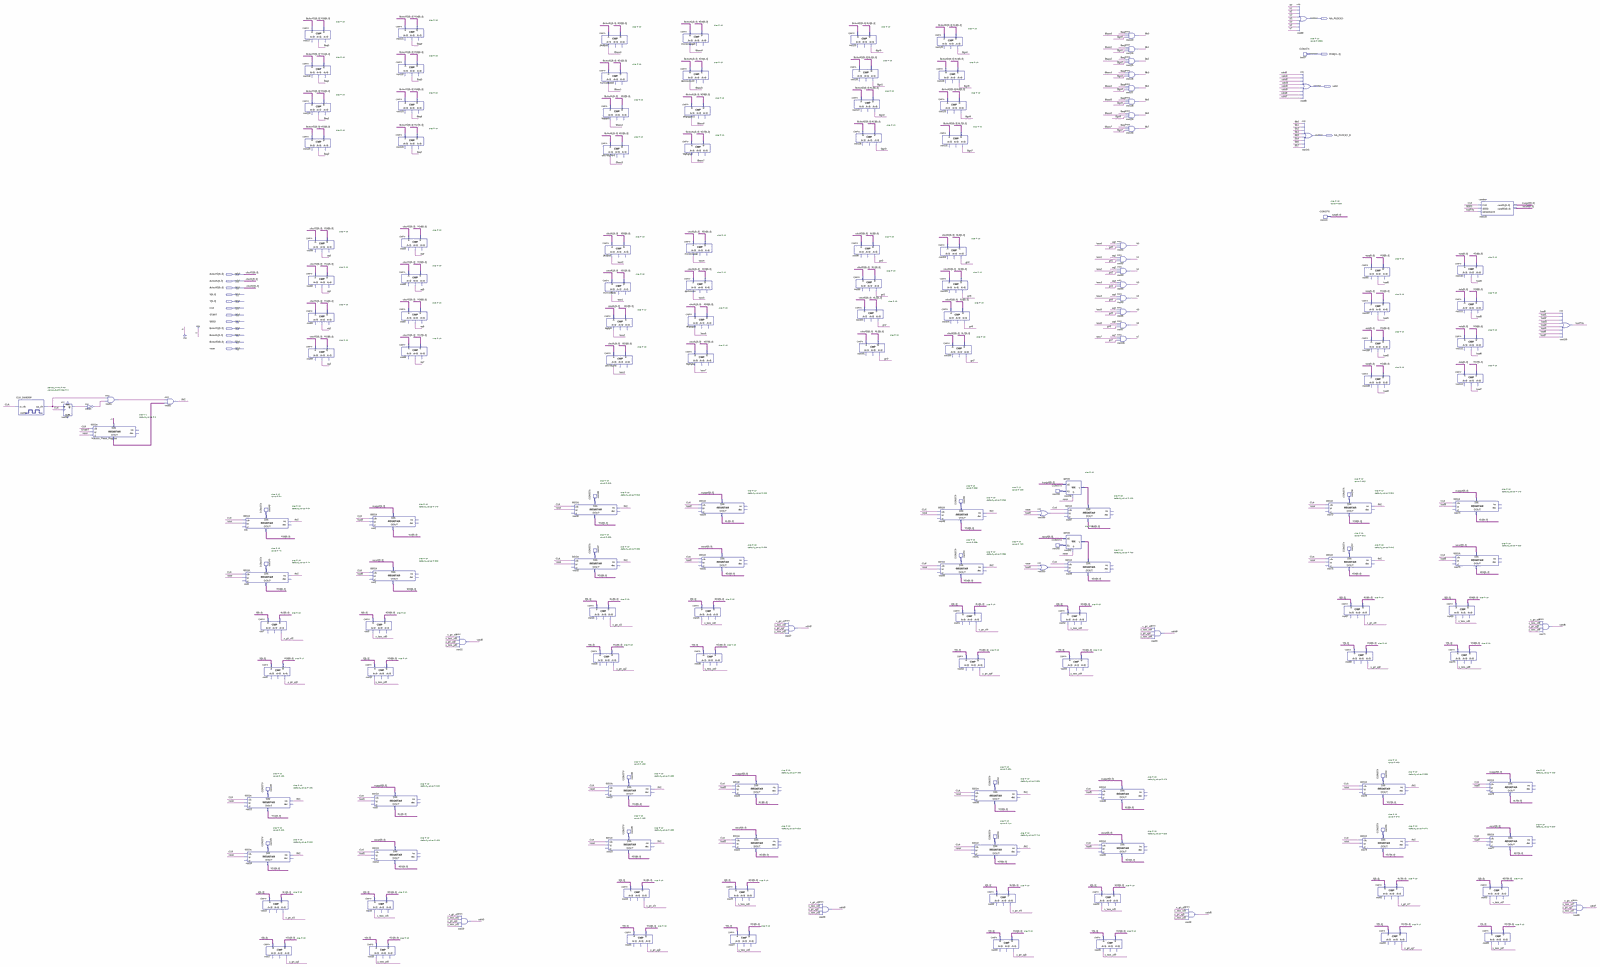
[diagram p0: schematic sheet, whole]
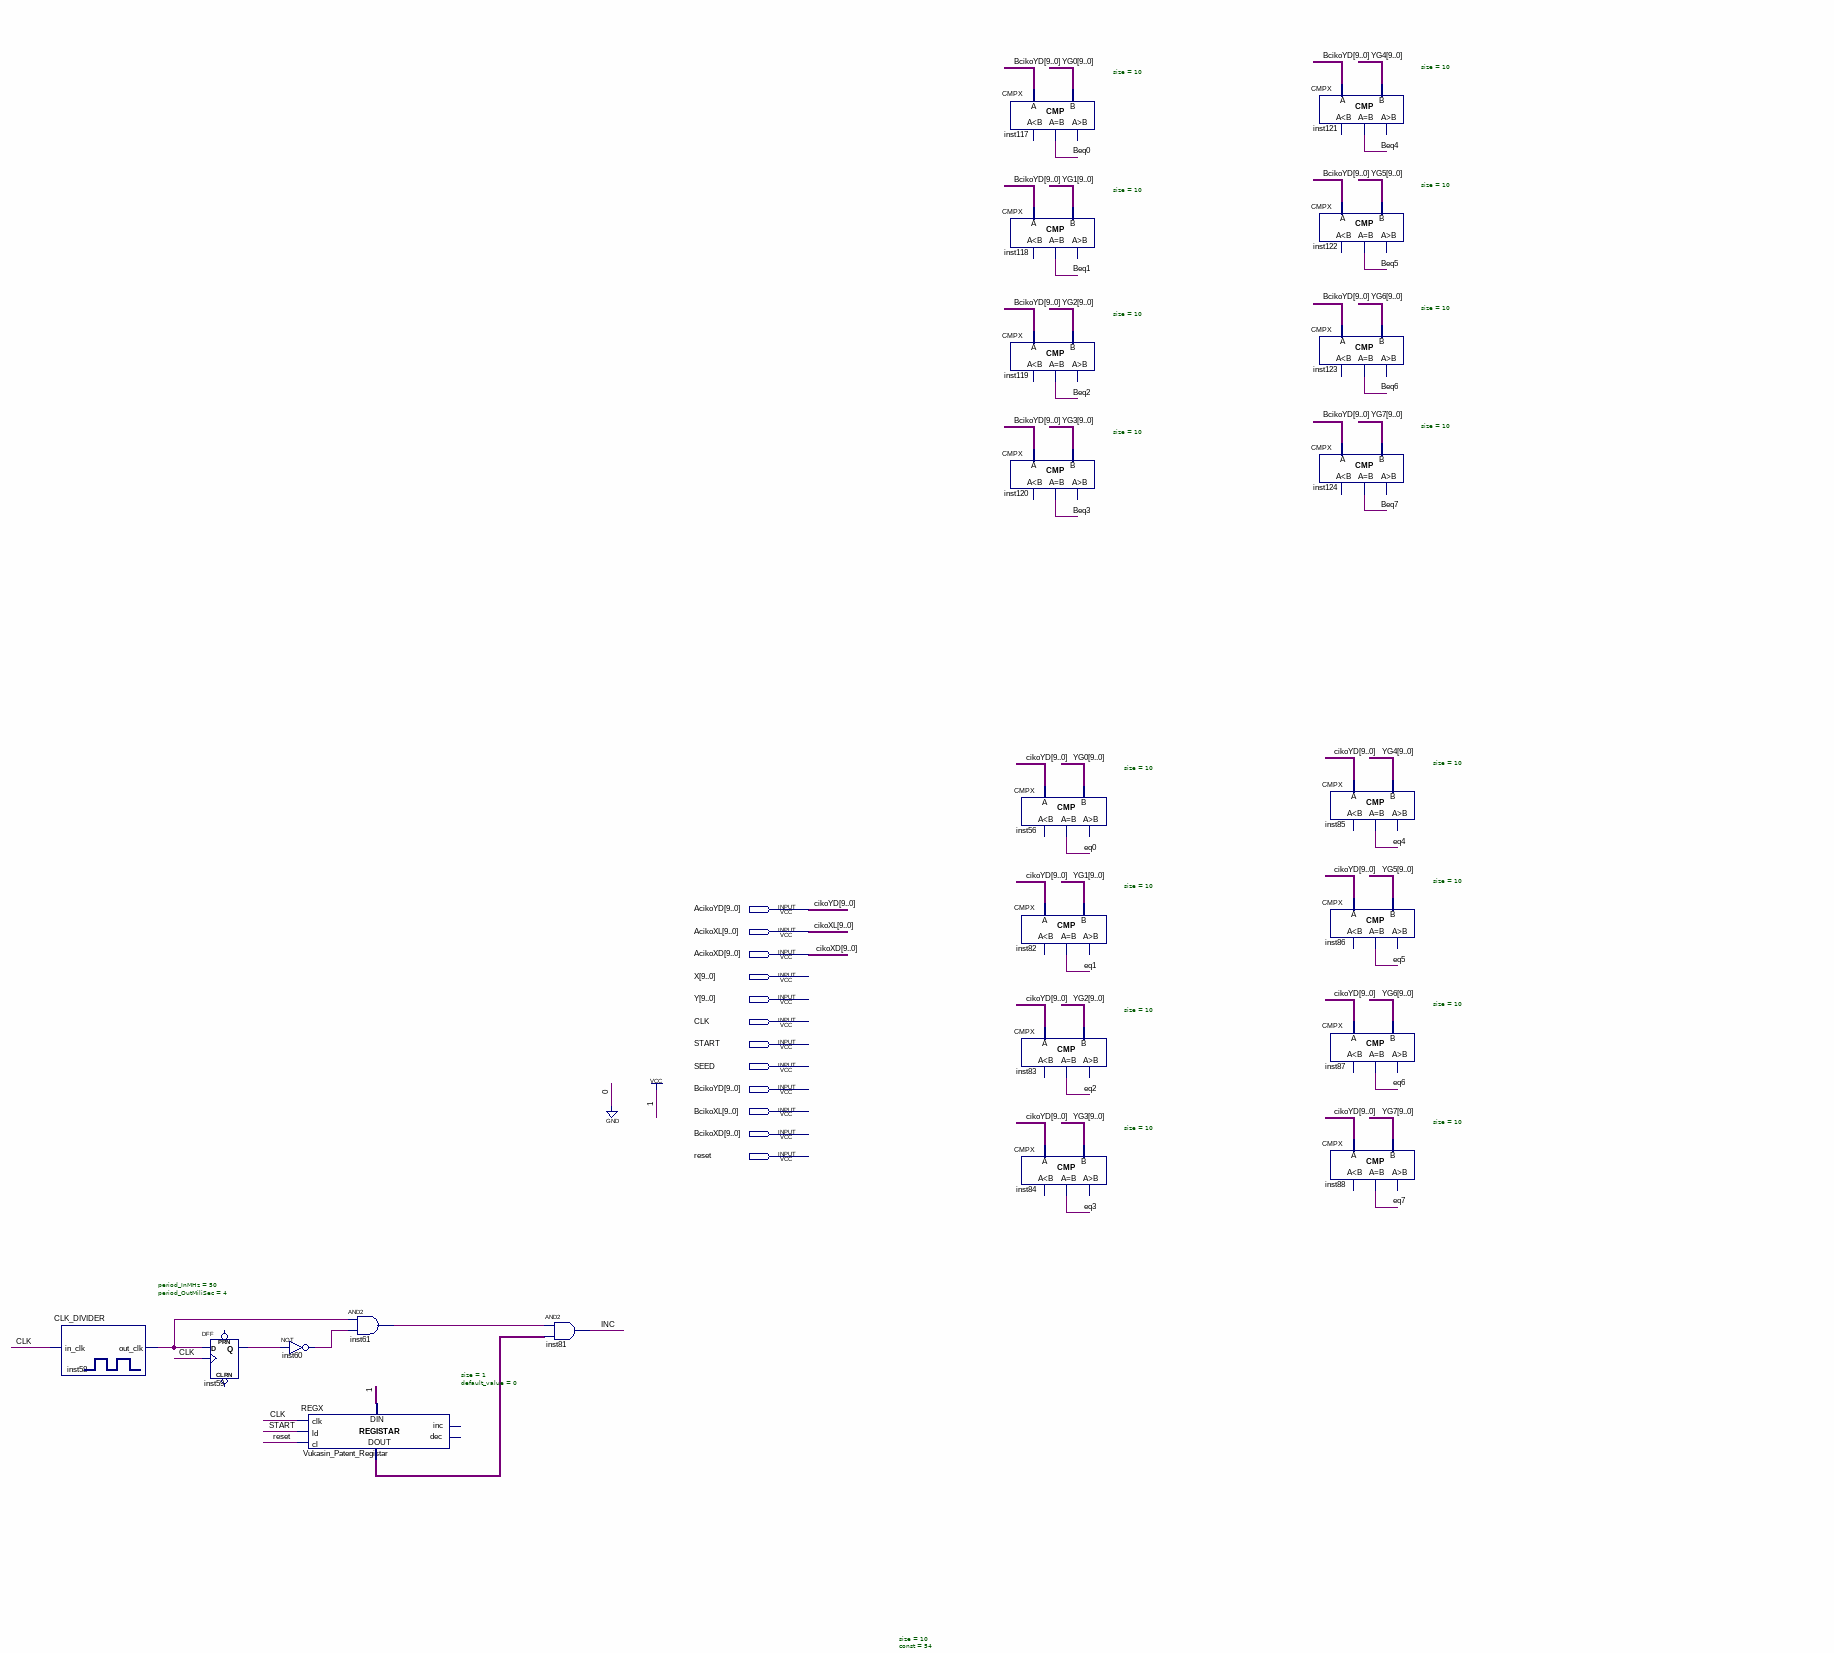
[diagram p1: schematic sheet, upper left part]
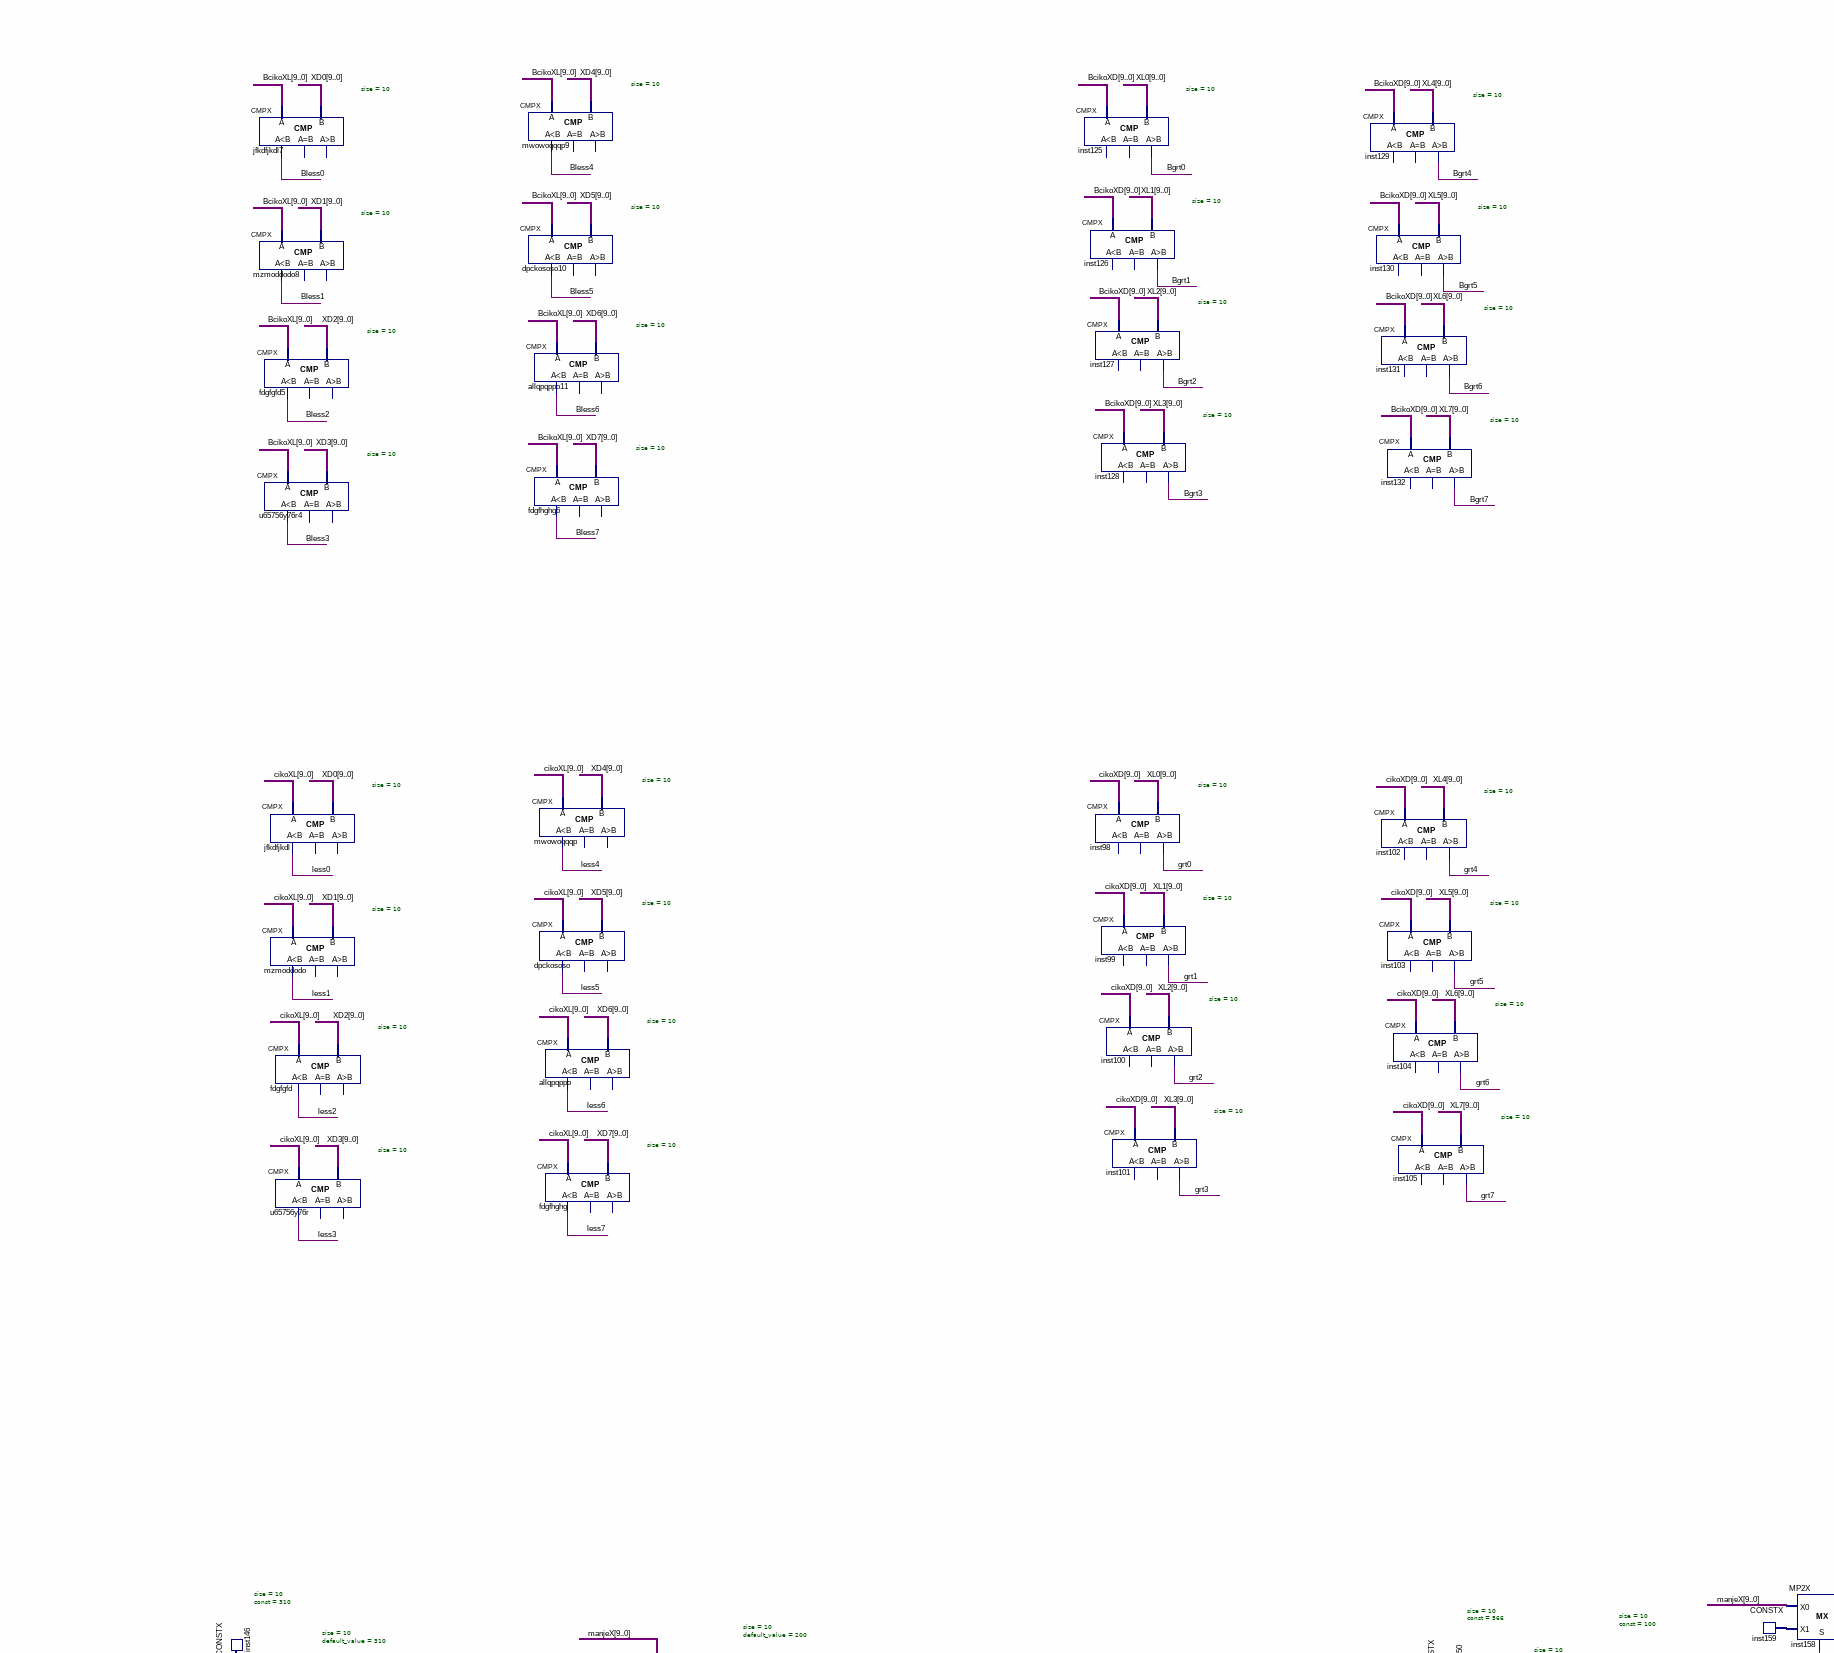
[diagram p2: schematic sheet, upper centre part]
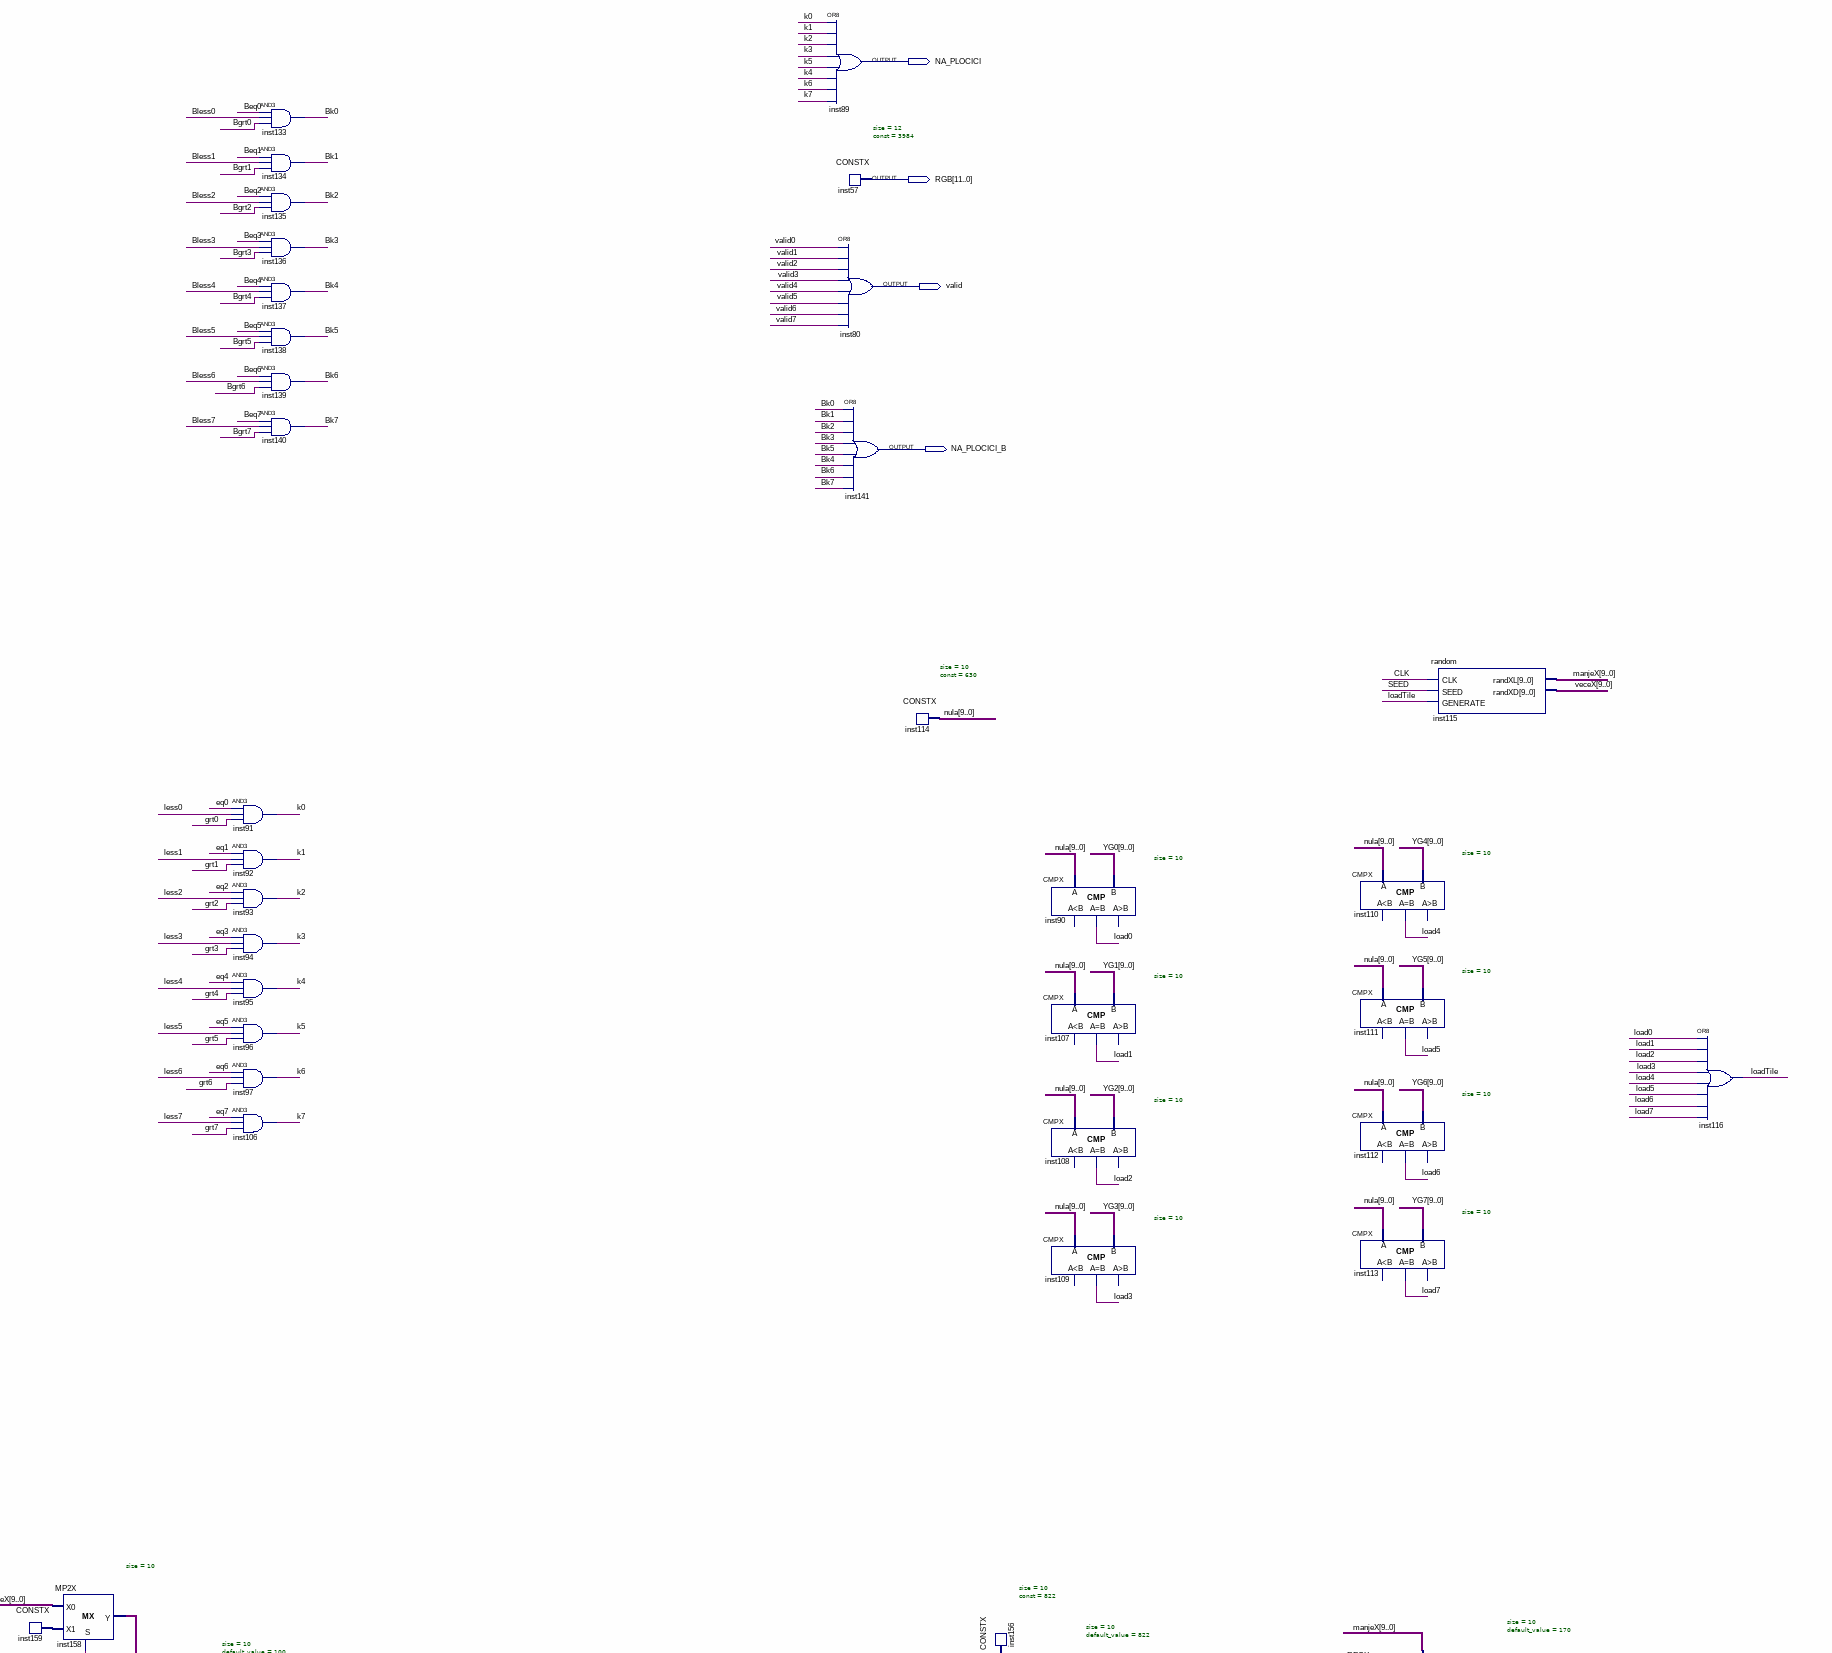
[diagram p3: schematic sheet, upper right part]
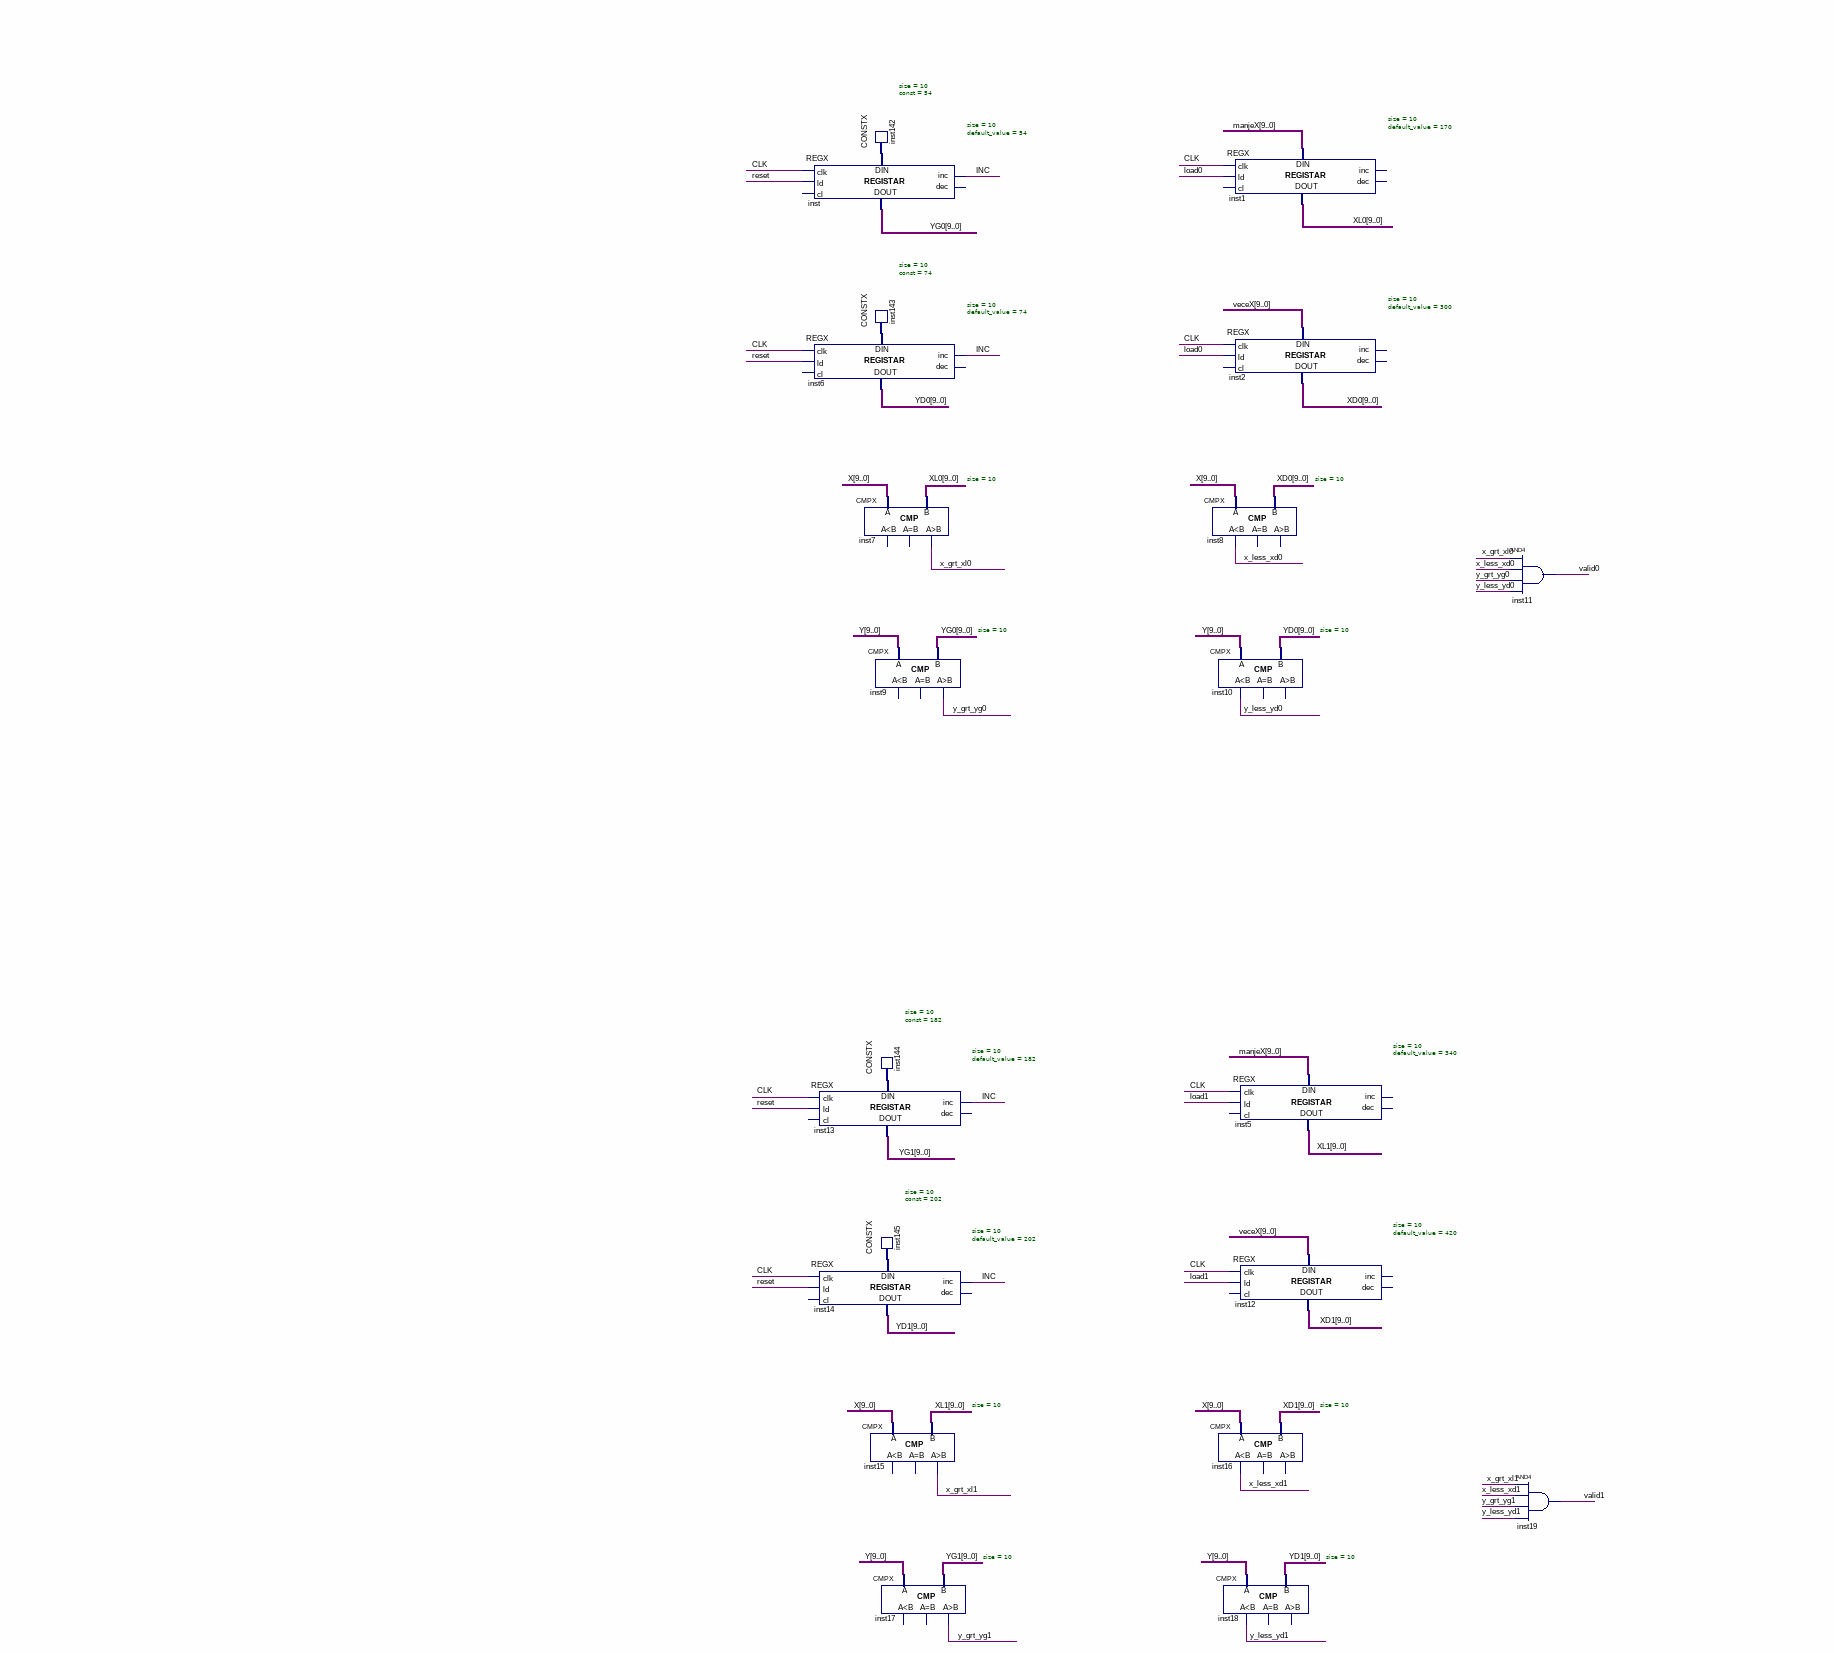
[diagram p4: schematic sheet, lower left part]
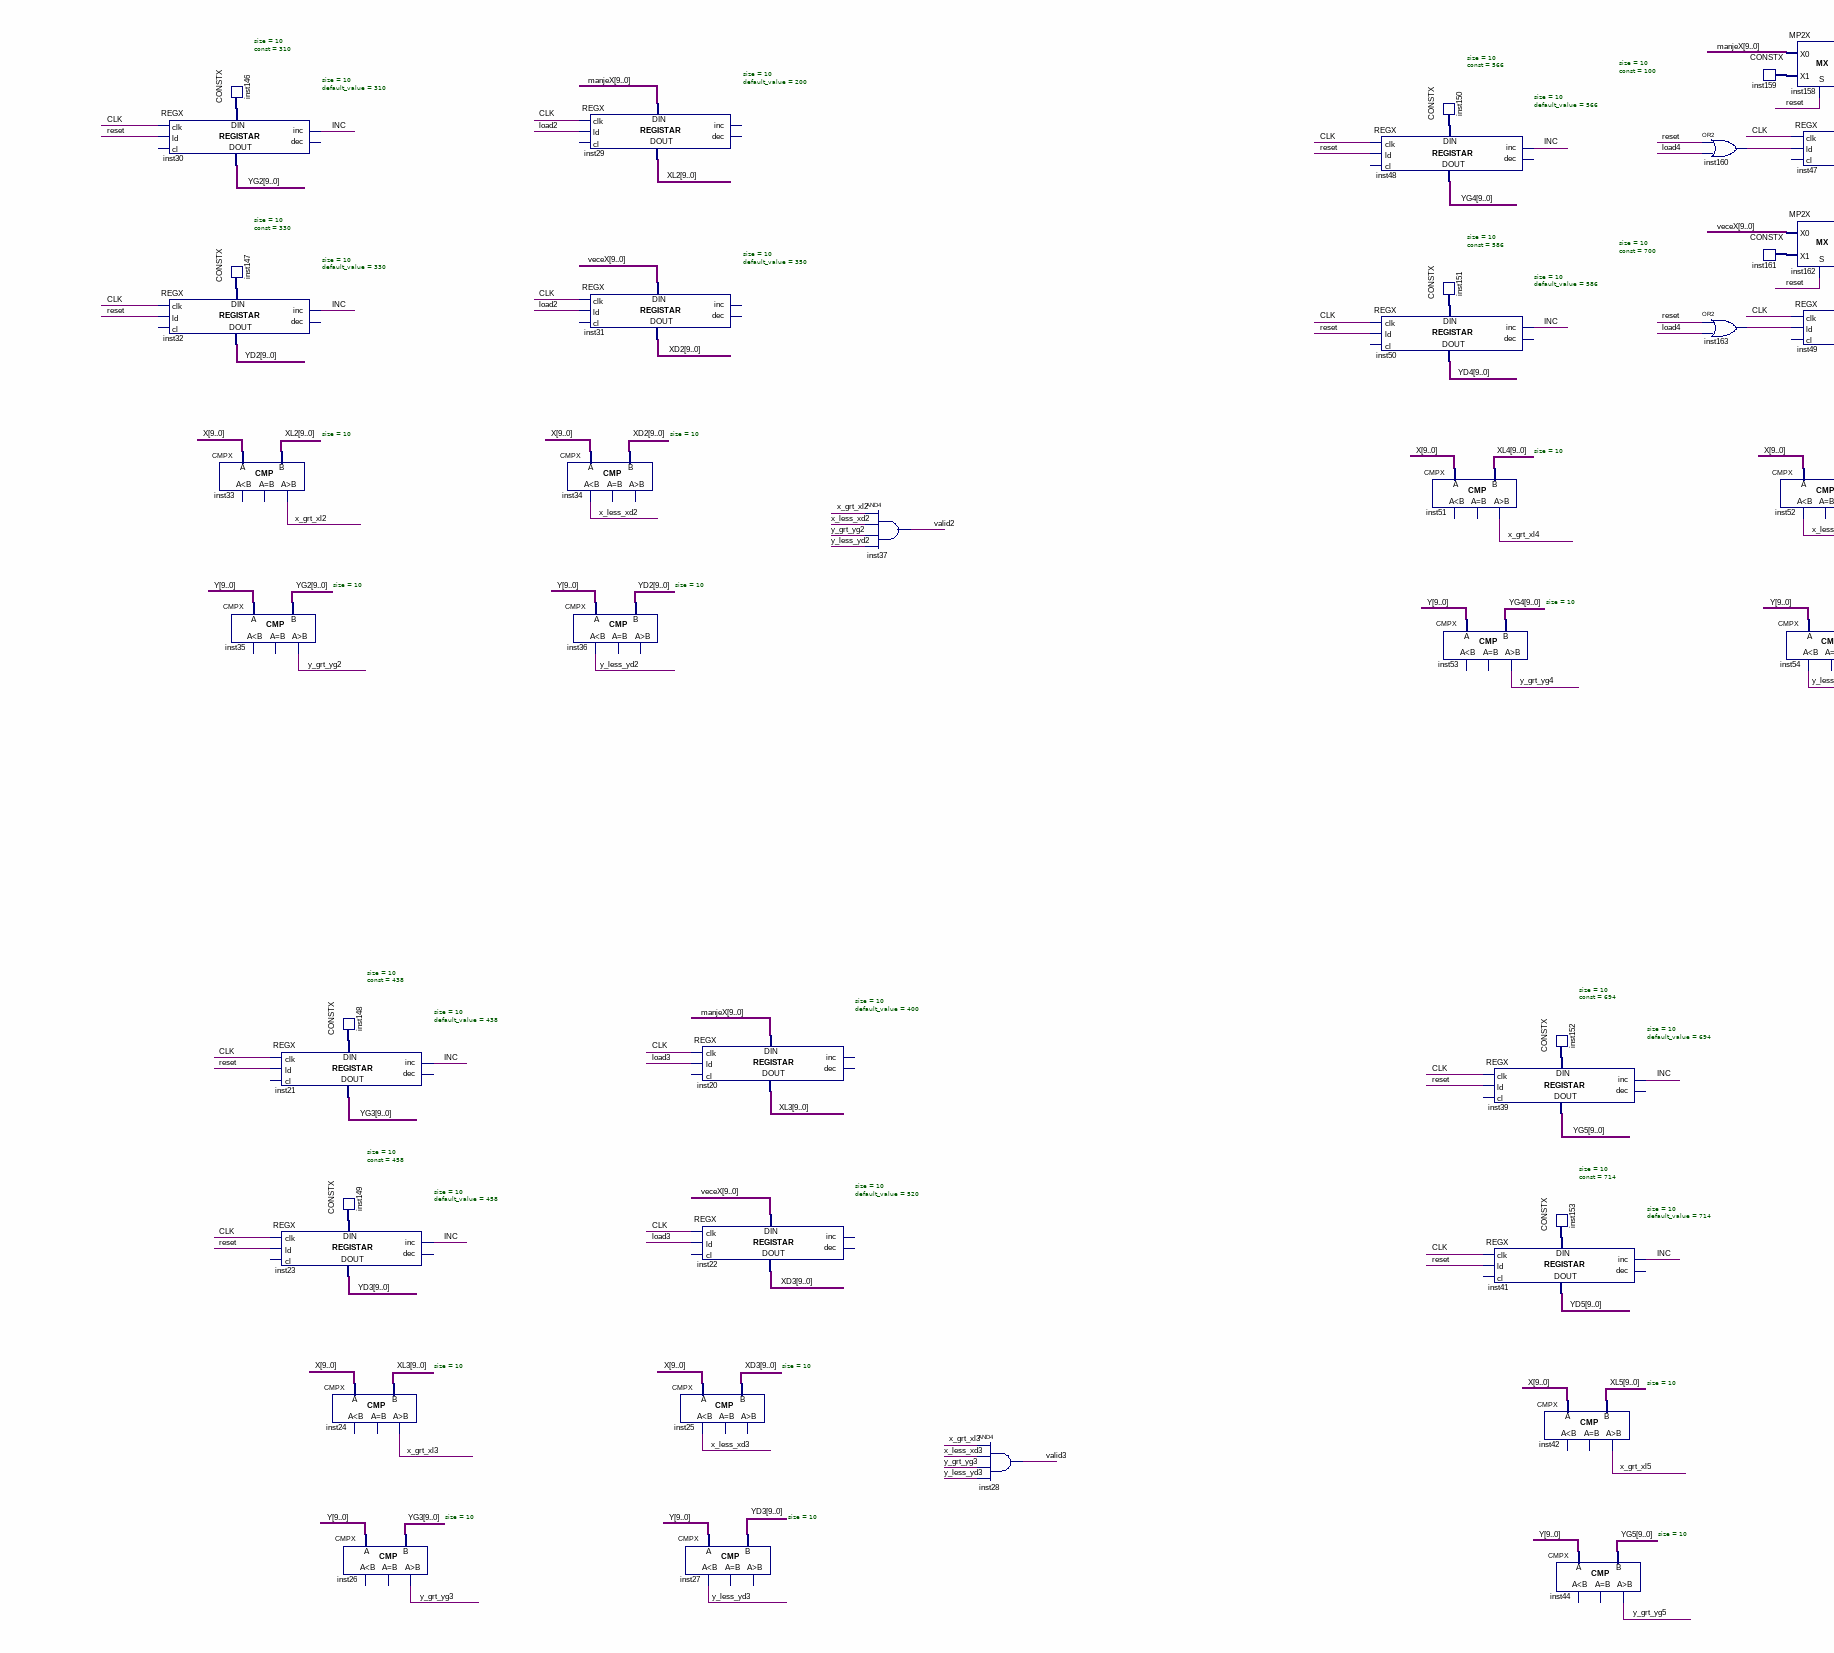
[diagram p5: schematic sheet, lower centre part]
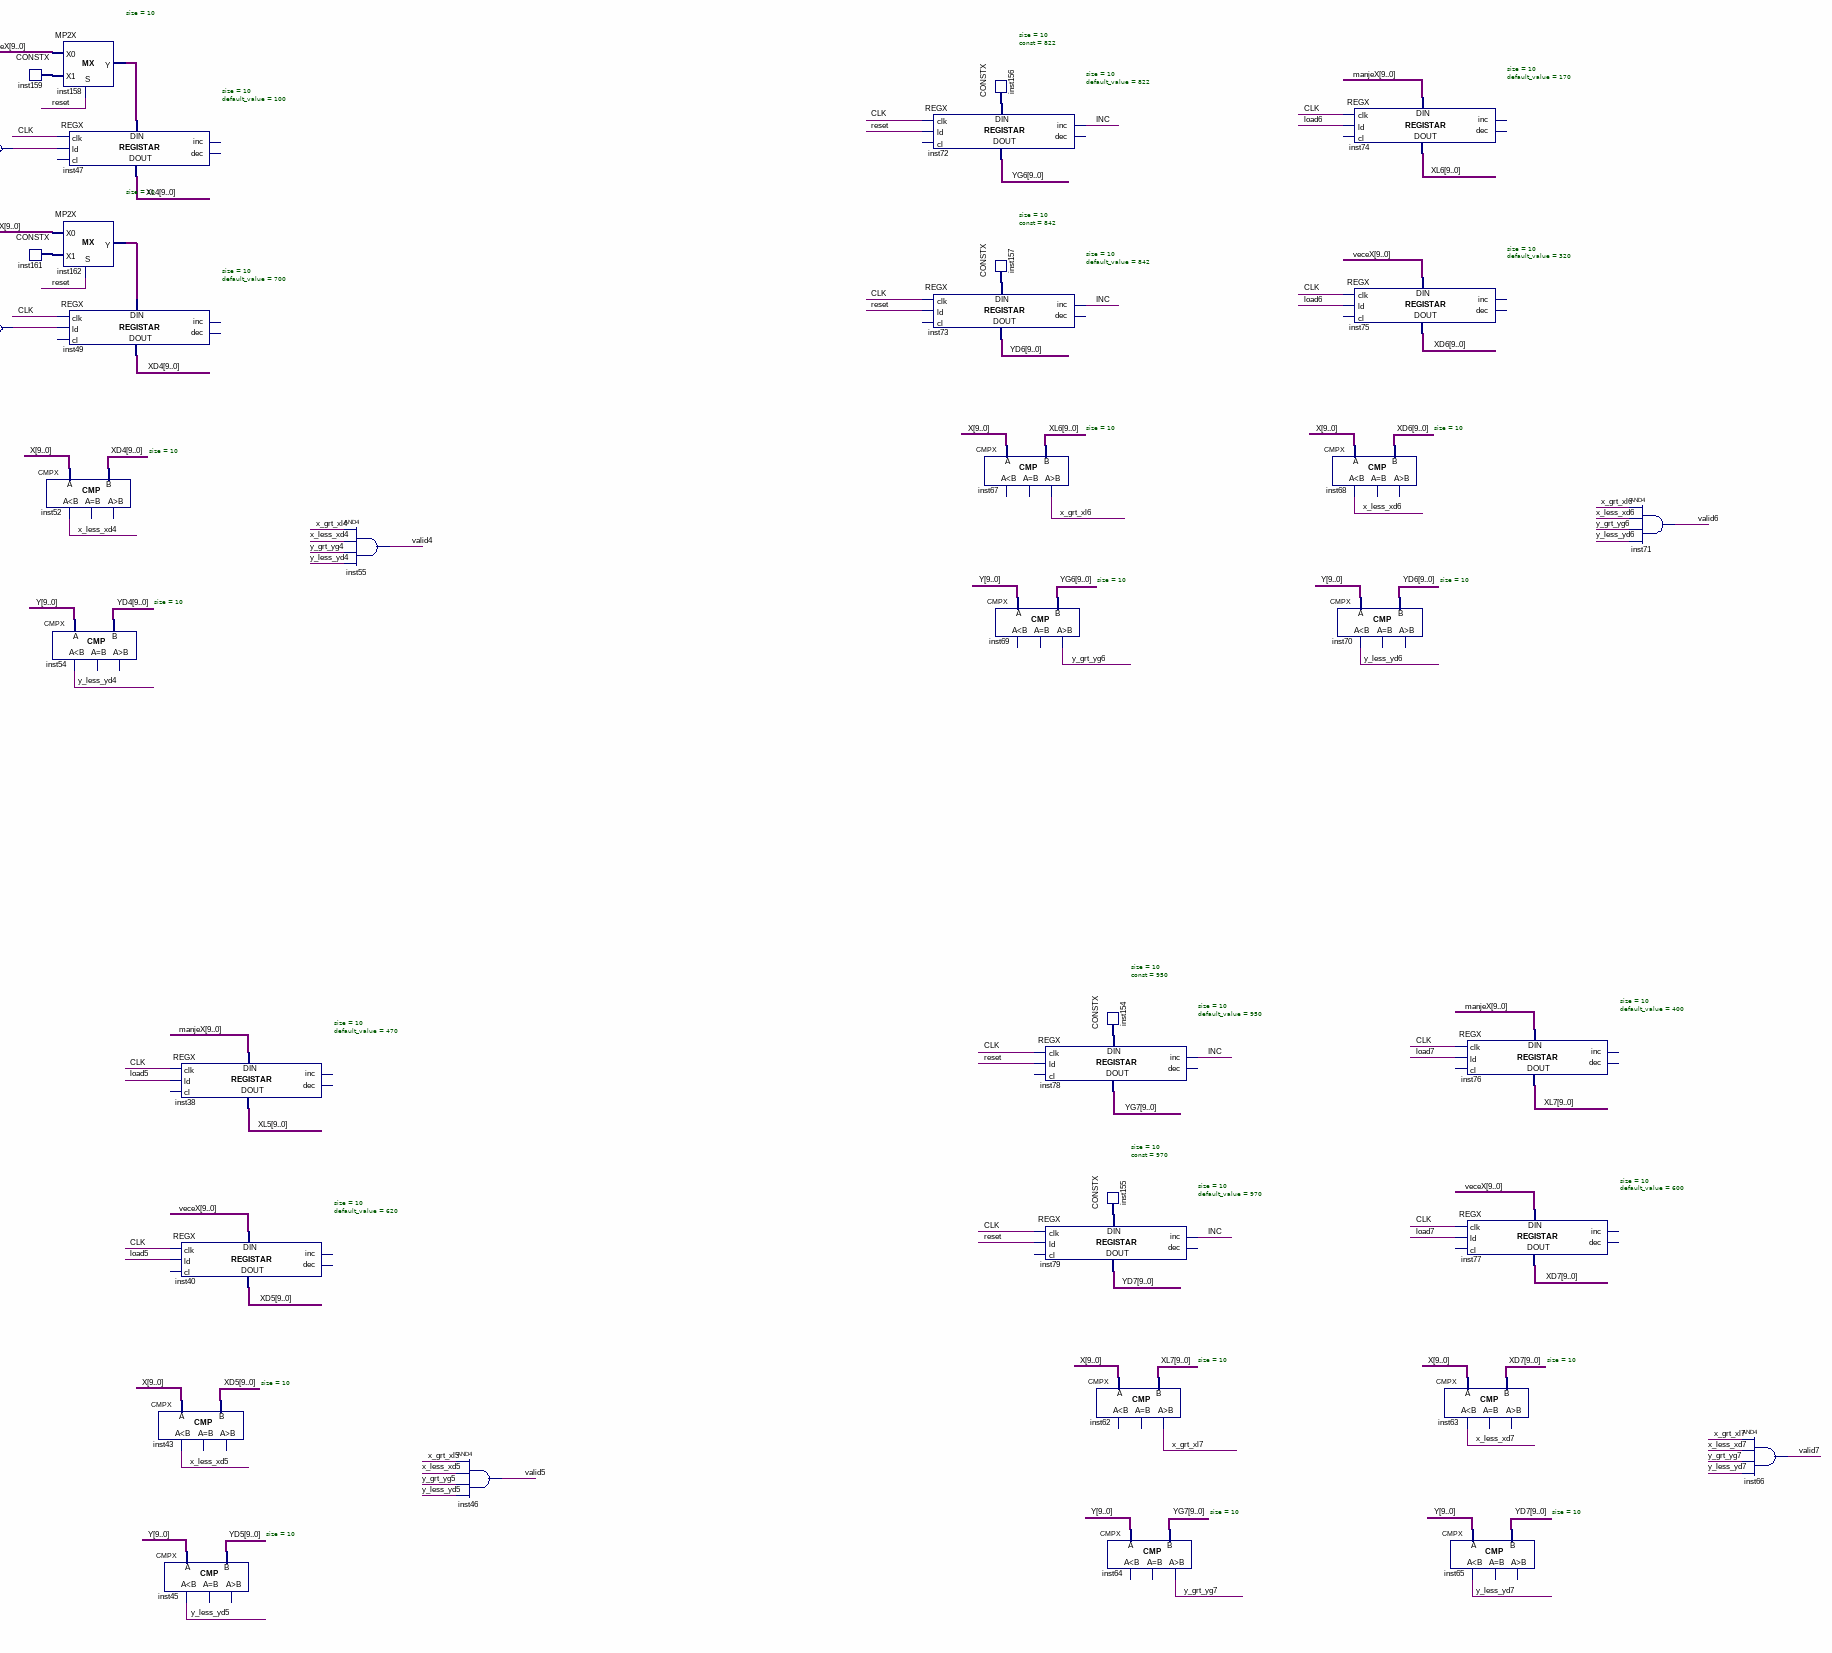
[diagram p6: schematic sheet, lower right part]
// Quartus schematic plocice.bdf as structural Verilog: 179 symbols, 16 pins
module plocice (
  input  [9:0] AcikoYD,
  input  [9:0] AcikoXL,
  input  [9:0] AcikoXD,
  input  [9:0] X,
  input  [9:0] Y,
  input  CLK,
  input  START,
  input  SEED,
  input  [9:0] BcikoYD,
  input  [9:0] BcikoXL,
  input  [9:0] BcikoXD,
  input  reset,
  output NA_PLOCICI,
  output [11:0] RGB,
  output valid,
  output NA_PLOCICI_B
);

  wire Beq0, Beq1, Beq2, Beq3, Beq4, Beq5, Beq6, Beq7, Bgrt0, Bgrt1, Bgrt2, Bgrt3, Bgrt4, Bgrt5, Bgrt6,
       Bgrt7, Bk0, Bk1, Bk2, Bk3, Bk4, Bk5, Bk6, Bk7, Bless0, Bless1, Bless2, Bless3, Bless4, Bless5, Bless6,
       Bless7, eq0, eq1, eq2, eq3, eq4, eq5, eq6, eq7, grt0, grt1, grt2, grt3, grt4, grt5, grt6, grt7, INC,
       inst58_out_clk, inst59_q, inst60_out, inst61_out, inst160_out, inst163_out, k0, k1, k2, k3, k4, k5,
       k6, k7, less0, less1, less2, less3, less4, less5, less6, less7, load0, load1, load2, load3, load4,
       load5, load6, load7, loadTile, valid0, valid1, valid2, valid3, valid4, valid5, valid6, valid7,
       Vukasin_Patent_Registar_data_out, x_grt_xl0, x_grt_xl1, x_grt_xl2, x_grt_xl3, x_grt_xl4, x_grt_xl5,
       x_grt_xl6, x_grt_xl7, x_less_xd0, x_less_xd1, x_less_xd2, x_less_xd3, x_less_xd4, x_less_xd5,
       x_less_xd6, x_less_xd7, y_grt_yg0, y_grt_yg1, y_grt_yg2, y_grt_yg3, y_grt_yg4, y_grt_yg5, y_grt_yg6,
       y_grt_yg7, y_less_yd0, y_less_yd1, y_less_yd2, y_less_yd3, y_less_yd4, y_less_yd5, y_less_yd6,
       y_less_yd7;
  wire [9:0] inst142_data, inst143_data, inst144_data, inst145_data, inst146_data, inst147_data,
       inst148_data, inst149_data, inst150_data, inst151_data, inst152_data, inst153_data, inst154_data,
       inst155_data, inst156_data, inst157_data, inst158_y, inst159_data, inst161_data, inst162_y, manjeX,
       nula, veceX, XD0, XD1, XD2, XD3, XD4, XD5, XD6, XD7, XL0, XL1, XL2, XL3, XL4, XL5, XL6, XL7, YD0, YD1,
       YD2, YD3, YD4, YD5, YD6, YD7, YG0, YG1, YG2, YG3, YG4, YG5, YG6, YG7;

  CLK_DIVIDER #(.period_InMHz(50), .period_OutMiliSec(4)) inst58 (.in_clk(CLK), .out_clk(inst58_out_clk));
  DFF inst59 (.CLK(CLK), .D(inst58_out_clk), .Q(inst59_q));  // open: CLRN, PRN
  not inst60 (inst60_out, inst59_q);
  REGX #(.size(1), .default_value(0)) Vukasin_Patent_Registar (
    .clk(CLK), .ld(START), .cl(reset), .data_in(1'b1), .data_out(Vukasin_Patent_Registar_data_out));  // open: inc, dec
  and inst61 (inst61_out, inst58_out_clk, inst60_out);
  and inst81 (INC, inst61_out, Vukasin_Patent_Registar_data_out);
  REGX #(.size(10), .default_value(54)) inst (
    .clk(CLK), .ld(reset), .inc(INC), .data_in(inst142_data), .data_out(YG0));  // open: cl, dec
  REGX #(.size(10), .default_value(74)) inst6 (
    .clk(CLK), .ld(reset), .inc(INC), .data_in(inst143_data), .data_out(YD0));  // open: cl, dec
  REGX #(.size(10), .default_value(182)) inst13 (
    .clk(CLK), .ld(reset), .inc(INC), .data_in(inst144_data), .data_out(YG1));  // open: cl, dec
  REGX #(.size(10), .default_value(202)) inst14 (
    .clk(CLK), .ld(reset), .inc(INC), .data_in(inst145_data), .data_out(YD1));  // open: cl, dec
  CONSTX #(.size(10), .\const (54)) inst142 (.data(inst142_data));
  CONSTX #(.size(10), .\const (74)) inst143 (.data(inst143_data));
  CMPX #(.size(10)) inst7 (.A(X), .B(XL0), .gr(x_grt_xl0));  // open: ls, eq
  CMPX #(.size(10)) inst9 (.A(Y), .B(YG0), .gr(y_grt_yg0));  // open: ls, eq
  CONSTX #(.size(10), .\const (182)) inst144 (.data(inst144_data));
  CONSTX #(.size(10), .\const (202)) inst145 (.data(inst145_data));
  CMPX #(.size(10)) inst15 (.A(X), .B(XL1), .gr(x_grt_xl1));  // open: ls, eq
  CMPX #(.size(10)) inst17 (.A(Y), .B(YG1), .gr(y_grt_yg1));  // open: ls, eq
  CMPX #(.size(10)) inst117 (.A(BcikoYD), .B(YG0), .eq(Beq0));  // open: ls, gr
  CMPX #(.size(10)) inst118 (.A(BcikoYD), .B(YG1), .eq(Beq1));  // open: ls, gr
  CMPX #(.size(10)) inst119 (.A(BcikoYD), .B(YG2), .eq(Beq2));  // open: ls, gr
  CMPX #(.size(10)) inst120 (.A(BcikoYD), .B(YG3), .eq(Beq3));  // open: ls, gr
  CMPX #(.size(10)) inst56 (.A(AcikoYD), .B(YG0), .eq(eq0));  // open: ls, gr
  CMPX #(.size(10)) inst82 (.A(AcikoYD), .B(YG1), .eq(eq1));  // open: ls, gr
  CMPX #(.size(10)) inst83 (.A(AcikoYD), .B(YG2), .eq(eq2));  // open: ls, gr
  CMPX #(.size(10)) inst84 (.A(AcikoYD), .B(YG3), .eq(eq3));  // open: ls, gr
  CMPX #(.size(10)) inst8 (.A(X), .B(XD0), .ls(x_less_xd0));  // open: eq, gr
  REGX #(.size(10), .default_value(170)) inst1 (
    .clk(CLK), .ld(load0), .data_in(manjeX), .data_out(XL0));  // open: cl, inc, dec
  REGX #(.size(10), .default_value(300)) inst2 (
    .clk(CLK), .ld(load0), .data_in(veceX), .data_out(XD0));  // open: cl, inc, dec
  CMPX #(.size(10)) inst10 (.A(Y), .B(YD0), .ls(y_less_yd0));  // open: eq, gr
  REGX #(.size(10), .default_value(340)) inst5 (
    .clk(CLK), .ld(load1), .data_in(manjeX), .data_out(XL1));  // open: cl, inc, dec
  REGX #(.size(10), .default_value(420)) inst12 (
    .clk(CLK), .ld(load1), .data_in(veceX), .data_out(XD1));  // open: cl, inc, dec
  CMPX #(.size(10)) inst16 (.A(X), .B(XD1), .ls(x_less_xd1));  // open: eq, gr
  CMPX #(.size(10)) inst18 (.A(Y), .B(YD1), .ls(y_less_yd1));  // open: eq, gr
  CMPX #(.size(10)) inst121 (.A(BcikoYD), .B(YG4), .eq(Beq4));  // open: ls, gr
  CMPX #(.size(10)) inst122 (.A(BcikoYD), .B(YG5), .eq(Beq5));  // open: ls, gr
  CMPX #(.size(10)) inst123 (.A(BcikoYD), .B(YG6), .eq(Beq6));  // open: ls, gr
  CMPX #(.size(10)) inst124 (.A(BcikoYD), .B(YG7), .eq(Beq7));  // open: ls, gr
  CMPX #(.size(10)) inst85 (.A(AcikoYD), .B(YG4), .eq(eq4));  // open: ls, gr
  CMPX #(.size(10)) inst86 (.A(AcikoYD), .B(YG5), .eq(eq5));  // open: ls, gr
  CMPX #(.size(10)) inst87 (.A(AcikoYD), .B(YG6), .eq(eq6));  // open: ls, gr
  CMPX #(.size(10)) inst88 (.A(AcikoYD), .B(YG7), .eq(eq7));  // open: ls, gr
  and inst11 (valid0, x_grt_xl0, x_less_xd0, y_grt_yg0, y_less_yd0);
  and inst19 (valid1, x_grt_xl1, x_less_xd1, y_grt_yg1, y_less_yd1);
  REGX #(.size(10), .default_value(310)) inst30 (
    .clk(CLK), .ld(reset), .inc(INC), .data_in(inst146_data), .data_out(YG2));  // open: cl, dec
  REGX #(.size(10), .default_value(330)) inst32 (
    .clk(CLK), .ld(reset), .inc(INC), .data_in(inst147_data), .data_out(YD2));  // open: cl, dec
  CONSTX #(.size(10), .\const (310)) inst146 (.data(inst146_data));
  CONSTX #(.size(10), .\const (330)) inst147 (.data(inst147_data));
  CMPX #(.size(10)) inst33 (.A(X), .B(XL2), .gr(x_grt_xl2));  // open: ls, eq
  CMPX #(.size(10)) inst35 (.A(Y), .B(YG2), .gr(y_grt_yg2));  // open: ls, eq
  CMPX #(.size(10)) jfkdfjkdl7 (.A(BcikoXL), .B(XD0), .ls(Bless0));  // open: eq, gr
  CMPX #(.size(10)) mzmoddodo8 (.A(BcikoXL), .B(XD1), .ls(Bless1));  // open: eq, gr
  CMPX #(.size(10)) fdgfgfd5 (.A(BcikoXL), .B(XD2), .ls(Bless2));  // open: eq, gr
  CMPX #(.size(10)) u65756y76r4 (.A(BcikoXL), .B(XD3), .ls(Bless3));  // open: eq, gr
  CMPX #(.size(10)) jfkdfjkdl (.A(AcikoXL), .B(XD0), .ls(less0));  // open: eq, gr
  CMPX #(.size(10)) mzmoddodo (.A(AcikoXL), .B(XD1), .ls(less1));  // open: eq, gr
  CMPX #(.size(10)) fdgfgfd (.A(AcikoXL), .B(XD2), .ls(less2));  // open: eq, gr
  CMPX #(.size(10)) u65756y76r (.A(AcikoXL), .B(XD3), .ls(less3));  // open: eq, gr
  REGX #(.size(10), .default_value(438)) inst21 (
    .clk(CLK), .ld(reset), .inc(INC), .data_in(inst148_data), .data_out(YG3));  // open: cl, dec
  REGX #(.size(10), .default_value(458)) inst23 (
    .clk(CLK), .ld(reset), .inc(INC), .data_in(inst149_data), .data_out(YD3));  // open: cl, dec
  CMPX #(.size(10)) inst24 (.A(X), .B(XL3), .gr(x_grt_xl3));  // open: ls, eq
  CONSTX #(.size(10), .\const (438)) inst148 (.data(inst148_data));
  CONSTX #(.size(10), .\const (458)) inst149 (.data(inst149_data));
  CMPX #(.size(10)) inst26 (.A(Y), .B(YG3), .gr(y_grt_yg3));  // open: ls, eq
  CMPX #(.size(10)) mwowoqqqp9 (.A(BcikoXL), .B(XD4), .ls(Bless4));  // open: eq, gr
  CMPX #(.size(10)) dpckososo10 (.A(BcikoXL), .B(XD5), .ls(Bless5));  // open: eq, gr
  CMPX #(.size(10)) allqpqppo11 (.A(BcikoXL), .B(XD6), .ls(Bless6));  // open: eq, gr
  CMPX #(.size(10)) fdgfhghg6 (.A(BcikoXL), .B(XD7), .ls(Bless7));  // open: eq, gr
  CMPX #(.size(10)) mwowoqqqp (.A(AcikoXL), .B(XD4), .ls(less4));  // open: eq, gr
  CMPX #(.size(10)) dpckososo (.A(AcikoXL), .B(XD5), .ls(less5));  // open: eq, gr
  CMPX #(.size(10)) allqpqppo (.A(AcikoXL), .B(XD6), .ls(less6));  // open: eq, gr
  CMPX #(.size(10)) fdgfhghg (.A(AcikoXL), .B(XD7), .ls(less7));  // open: eq, gr
  REGX #(.size(10), .default_value(200)) inst29 (
    .clk(CLK), .ld(load2), .data_in(manjeX), .data_out(XL2));  // open: cl, inc, dec
  REGX #(.size(10), .default_value(350)) inst31 (
    .clk(CLK), .ld(load2), .data_in(veceX), .data_out(XD2));  // open: cl, inc, dec
  CMPX #(.size(10)) inst34 (.A(X), .B(XD2), .ls(x_less_xd2));  // open: eq, gr
  CMPX #(.size(10)) inst36 (.A(Y), .B(YD2), .ls(y_less_yd2));  // open: eq, gr
  CMPX #(.size(10)) inst25 (.A(X), .B(XD3), .ls(x_less_xd3));  // open: eq, gr
  CMPX #(.size(10)) inst27 (.A(Y), .B(YD3), .ls(y_less_yd3));  // open: eq, gr
  REGX #(.size(10), .default_value(400)) inst20 (
    .clk(CLK), .ld(load3), .data_in(manjeX), .data_out(XL3));  // open: cl, inc, dec
  REGX #(.size(10), .default_value(520)) inst22 (
    .clk(CLK), .ld(load3), .data_in(veceX), .data_out(XD3));  // open: cl, inc, dec
  and inst37 (valid2, x_grt_xl2, x_less_xd2, y_grt_yg2, y_less_yd2);
  and inst28 (valid3, x_grt_xl3, x_less_xd3, y_grt_yg3, y_less_yd3);
  CMPX #(.size(10)) inst125 (.A(BcikoXD), .B(XL0), .gr(Bgrt0));  // open: ls, eq
  CMPX #(.size(10)) inst126 (.A(BcikoXD), .B(XL1), .gr(Bgrt1));  // open: ls, eq
  CMPX #(.size(10)) inst127 (.A(BcikoXD), .B(XL2), .gr(Bgrt2));  // open: ls, eq
  CMPX #(.size(10)) inst98 (.A(AcikoXD), .B(XL0), .gr(grt0));  // open: ls, eq
  CMPX #(.size(10)) inst128 (.A(BcikoXD), .B(XL3), .gr(Bgrt3));  // open: ls, eq
  CMPX #(.size(10)) inst99 (.A(AcikoXD), .B(XL1), .gr(grt1));  // open: ls, eq
  CMPX #(.size(10)) inst100 (.A(AcikoXD), .B(XL2), .gr(grt2));  // open: ls, eq
  CMPX #(.size(10)) inst101 (.A(AcikoXD), .B(XL3), .gr(grt3));  // open: ls, eq
  CMPX #(.size(10)) inst129 (.A(BcikoXD), .B(XL4), .gr(Bgrt4));  // open: ls, eq
  CMPX #(.size(10)) inst130 (.A(BcikoXD), .B(XL5), .gr(Bgrt5));  // open: ls, eq
  CMPX #(.size(10)) inst131 (.A(BcikoXD), .B(XL6), .gr(Bgrt6));  // open: ls, eq
  CMPX #(.size(10)) inst132 (.A(BcikoXD), .B(XL7), .gr(Bgrt7));  // open: ls, eq
  CMPX #(.size(10)) inst102 (.A(AcikoXD), .B(XL4), .gr(grt4));  // open: ls, eq
  CMPX #(.size(10)) inst103 (.A(AcikoXD), .B(XL5), .gr(grt5));  // open: ls, eq
  CMPX #(.size(10)) inst104 (.A(AcikoXD), .B(XL6), .gr(grt6));  // open: ls, eq
  CMPX #(.size(10)) inst105 (.A(AcikoXD), .B(XL7), .gr(grt7));  // open: ls, eq
  REGX #(.size(10), .default_value(566)) inst48 (
    .clk(CLK), .ld(reset), .inc(INC), .data_in(inst150_data), .data_out(YG4));  // open: cl, dec
  REGX #(.size(10), .default_value(586)) inst50 (
    .clk(CLK), .ld(reset), .inc(INC), .data_in(inst151_data), .data_out(YD4));  // open: cl, dec
  CONSTX #(.size(10), .\const (566)) inst150 (.data(inst150_data));
  CONSTX #(.size(10), .\const (586)) inst151 (.data(inst151_data));
  CMPX #(.size(10)) inst51 (.A(X), .B(XL4), .gr(x_grt_xl4));  // open: ls, eq
  CMPX #(.size(10)) inst53 (.A(Y), .B(YG4), .gr(y_grt_yg4));  // open: ls, eq
  REGX #(.size(10), .default_value(694)) inst39 (
    .clk(CLK), .ld(reset), .inc(INC), .data_in(inst152_data), .data_out(YG5));  // open: cl, dec
  REGX #(.size(10), .default_value(714)) inst41 (
    .clk(CLK), .ld(reset), .inc(INC), .data_in(inst153_data), .data_out(YD5));  // open: cl, dec
  CMPX #(.size(10)) inst42 (.A(X), .B(XL5), .gr(x_grt_xl5));  // open: ls, eq
  CONSTX #(.size(10), .\const (694)) inst152 (.data(inst152_data));
  CONSTX #(.size(10), .\const (714)) inst153 (.data(inst153_data));
  CMPX #(.size(10)) inst44 (.A(Y), .B(YG5), .gr(y_grt_yg5));  // open: ls, eq
  or inst160 (inst160_out, reset, load4);
  or inst163 (inst163_out, reset, load4);
  CONSTX #(.size(10), .\const (100)) inst159 (.data(inst159_data));
  CONSTX #(.size(10), .\const (700)) inst161 (.data(inst161_data));
  MP2X #(.size(10)) inst158 (.S(reset), .X0(manjeX), .X1(inst159_data), .Y(inst158_y));
  REGX #(.size(10), .default_value(100)) inst47 (
    .clk(CLK), .ld(inst160_out), .data_in(inst158_y), .data_out(XL4));  // open: cl, inc, dec
  MP2X #(.size(10)) inst162 (.S(reset), .X0(veceX), .X1(inst161_data), .Y(inst162_y));
  REGX #(.size(10), .default_value(700)) inst49 (
    .clk(CLK), .ld(inst163_out), .data_in(inst162_y), .data_out(XD4));  // open: cl, inc, dec
  CMPX #(.size(10)) inst52 (.A(X), .B(XD4), .ls(x_less_xd4));  // open: eq, gr
  CMPX #(.size(10)) inst54 (.A(Y), .B(YD4), .ls(y_less_yd4));  // open: eq, gr
  CMPX #(.size(10)) inst43 (.A(X), .B(XD5), .ls(x_less_xd5));  // open: eq, gr
  CMPX #(.size(10)) inst45 (.A(Y), .B(YD5), .ls(y_less_yd5));  // open: eq, gr
  REGX #(.size(10), .default_value(470)) inst38 (
    .clk(CLK), .ld(load5), .data_in(manjeX), .data_out(XL5));  // open: cl, inc, dec
  REGX #(.size(10), .default_value(620)) inst40 (
    .clk(CLK), .ld(load5), .data_in(veceX), .data_out(XD5));  // open: cl, inc, dec
  and inst91 (k0, eq0, less0, grt0);
  and inst92 (k1, eq1, less1, grt1);
  and inst93 (k2, eq2, less2, grt2);
  and inst94 (k3, eq3, less3, grt3);
  and inst95 (k4, eq4, less4, grt4);
  and inst96 (k5, eq5, less5, grt5);
  and inst97 (k6, eq6, less6, grt6);
  and inst106 (k7, eq7, less7, grt7);
  and inst133 (Bk0, Beq0, Bless0, Bgrt0);
  and inst134 (Bk1, Beq1, Bless1, Bgrt1);
  and inst135 (Bk2, Beq2, Bless2, Bgrt2);
  and inst136 (Bk3, Beq3, Bless3, Bgrt3);
  and inst137 (Bk4, Beq4, Bless4, Bgrt4);
  and inst138 (Bk5, Beq5, Bless5, Bgrt5);
  and inst139 (Bk6, Beq6, Bless6, Bgrt6);
  and inst140 (Bk7, Beq7, Bless7, Bgrt7);
  and inst55 (valid4, x_grt_xl4, x_less_xd4, y_grt_yg4, y_less_yd4);
  and inst46 (valid5, x_grt_xl5, x_less_xd5, y_grt_yg5, y_less_yd5);
  or inst89 (NA_PLOCICI, k0, k1, k2, k3, k5, k4, k6, k7);
  CONSTX #(.size(12), .\const (3984)) inst57 (.data(RGB));
  or inst80 (valid, valid0, valid1, valid2, valid3, valid4, valid5, valid6, valid7);
  or inst141 (NA_PLOCICI_B, Bk0, Bk1, Bk2, Bk3, Bk5, Bk4, Bk6, Bk7);
  CONSTX #(.size(10), .\const (630)) inst114 (.data(nula));
  REGX #(.size(10), .default_value(822)) inst72 (
    .clk(CLK), .ld(reset), .inc(INC), .data_in(inst156_data), .data_out(YG6));  // open: cl, dec
  REGX #(.size(10), .default_value(842)) inst73 (
    .clk(CLK), .ld(reset), .inc(INC), .data_in(inst157_data), .data_out(YD6));  // open: cl, dec
  CONSTX #(.size(10), .\const (822)) inst156 (.data(inst156_data));
  CONSTX #(.size(10), .\const (842)) inst157 (.data(inst157_data));
  CMPX #(.size(10)) inst67 (.A(X), .B(XL6), .gr(x_grt_xl6));  // open: ls, eq
  CMPX #(.size(10)) inst69 (.A(Y), .B(YG6), .gr(y_grt_yg6));  // open: ls, eq
  CMPX #(.size(10)) inst90 (.A(nula), .B(YG0), .eq(load0));  // open: ls, gr
  CMPX #(.size(10)) inst107 (.A(nula), .B(YG1), .eq(load1));  // open: ls, gr
  CMPX #(.size(10)) inst108 (.A(nula), .B(YG2), .eq(load2));  // open: ls, gr
  CMPX #(.size(10)) inst109 (.A(nula), .B(YG3), .eq(load3));  // open: ls, gr
  REGX #(.size(10), .default_value(950)) inst78 (
    .clk(CLK), .ld(reset), .inc(INC), .data_in(inst154_data), .data_out(YG7));  // open: cl, dec
  REGX #(.size(10), .default_value(970)) inst79 (
    .clk(CLK), .ld(reset), .inc(INC), .data_in(inst155_data), .data_out(YD7));  // open: cl, dec
  CONSTX #(.size(10), .\const (950)) inst154 (.data(inst154_data));
  CONSTX #(.size(10), .\const (970)) inst155 (.data(inst155_data));
  CMPX #(.size(10)) inst62 (.A(X), .B(XL7), .gr(x_grt_xl7));  // open: ls, eq
  CMPX #(.size(10)) inst64 (.A(Y), .B(YG7), .gr(y_grt_yg7));  // open: ls, eq
  CMPX #(.size(10)) inst68 (.A(X), .B(XD6), .ls(x_less_xd6));  // open: eq, gr
  CMPX #(.size(10)) inst70 (.A(Y), .B(YD6), .ls(y_less_yd6));  // open: eq, gr
  CMPX #(.size(10)) inst110 (.A(nula), .B(YG4), .eq(load4));  // open: ls, gr
  CMPX #(.size(10)) inst111 (.A(nula), .B(YG5), .eq(load5));  // open: ls, gr
  CMPX #(.size(10)) inst112 (.A(nula), .B(YG6), .eq(load6));  // open: ls, gr
  CMPX #(.size(10)) inst113 (.A(nula), .B(YG7), .eq(load7));  // open: ls, gr
  REGX #(.size(10), .default_value(170)) inst74 (
    .clk(CLK), .ld(load6), .data_in(manjeX), .data_out(XL6));  // open: cl, inc, dec
  REGX #(.size(10), .default_value(320)) inst75 (
    .clk(CLK), .ld(load6), .data_in(veceX), .data_out(XD6));  // open: cl, inc, dec
  random inst115 (.CLK(CLK), .SEED(SEED), .GENERATE(loadTile), .randXL(manjeX), .randXD(veceX));
  REGX #(.size(10), .default_value(400)) inst76 (
    .clk(CLK), .ld(load7), .data_in(manjeX), .data_out(XL7));  // open: cl, inc, dec
  REGX #(.size(10), .default_value(600)) inst77 (
    .clk(CLK), .ld(load7), .data_in(veceX), .data_out(XD7));  // open: cl, inc, dec
  CMPX #(.size(10)) inst63 (.A(X), .B(XD7), .ls(x_less_xd7));  // open: eq, gr
  CMPX #(.size(10)) inst65 (.A(Y), .B(YD7), .ls(y_less_yd7));  // open: eq, gr
  and inst71 (valid6, x_grt_xl6, x_less_xd6, y_grt_yg6, y_less_yd6);
  or inst116 (loadTile, load0, load1, load2, load3, load4, load5, load6, load7);
  and inst66 (valid7, x_grt_xl7, x_less_xd7, y_grt_yg7, y_less_yd7);

  // Other names for the same wires on the sheet: cikoXD[9:0] = AcikoXD; cikoXL[9:0] = AcikoXL; cikoYD[9:0] = AcikoYD
endmodule
